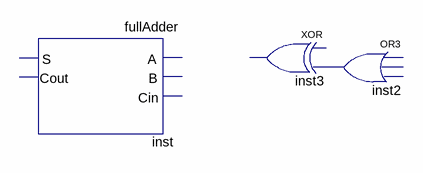
[diagram p0: schematic sheet]
// Quartus schematic band5exp1.bdf as structural Verilog: 3 symbols, 0 pins
module band5exp1 (
);

  wire inst2_out;

  fullAdder inst ();  // open: A, B, Cin, S, Cout
  // XOR inst3 has open pins: IN1=open, IN2=inst2_out, OUT=open
  // OR3 inst2 has open pins: IN1=open, IN2=open, IN3=open, OUT=inst2_out
endmodule
